# EAGLE design RhythmMachine-Master (EAGLE 7.2.0)
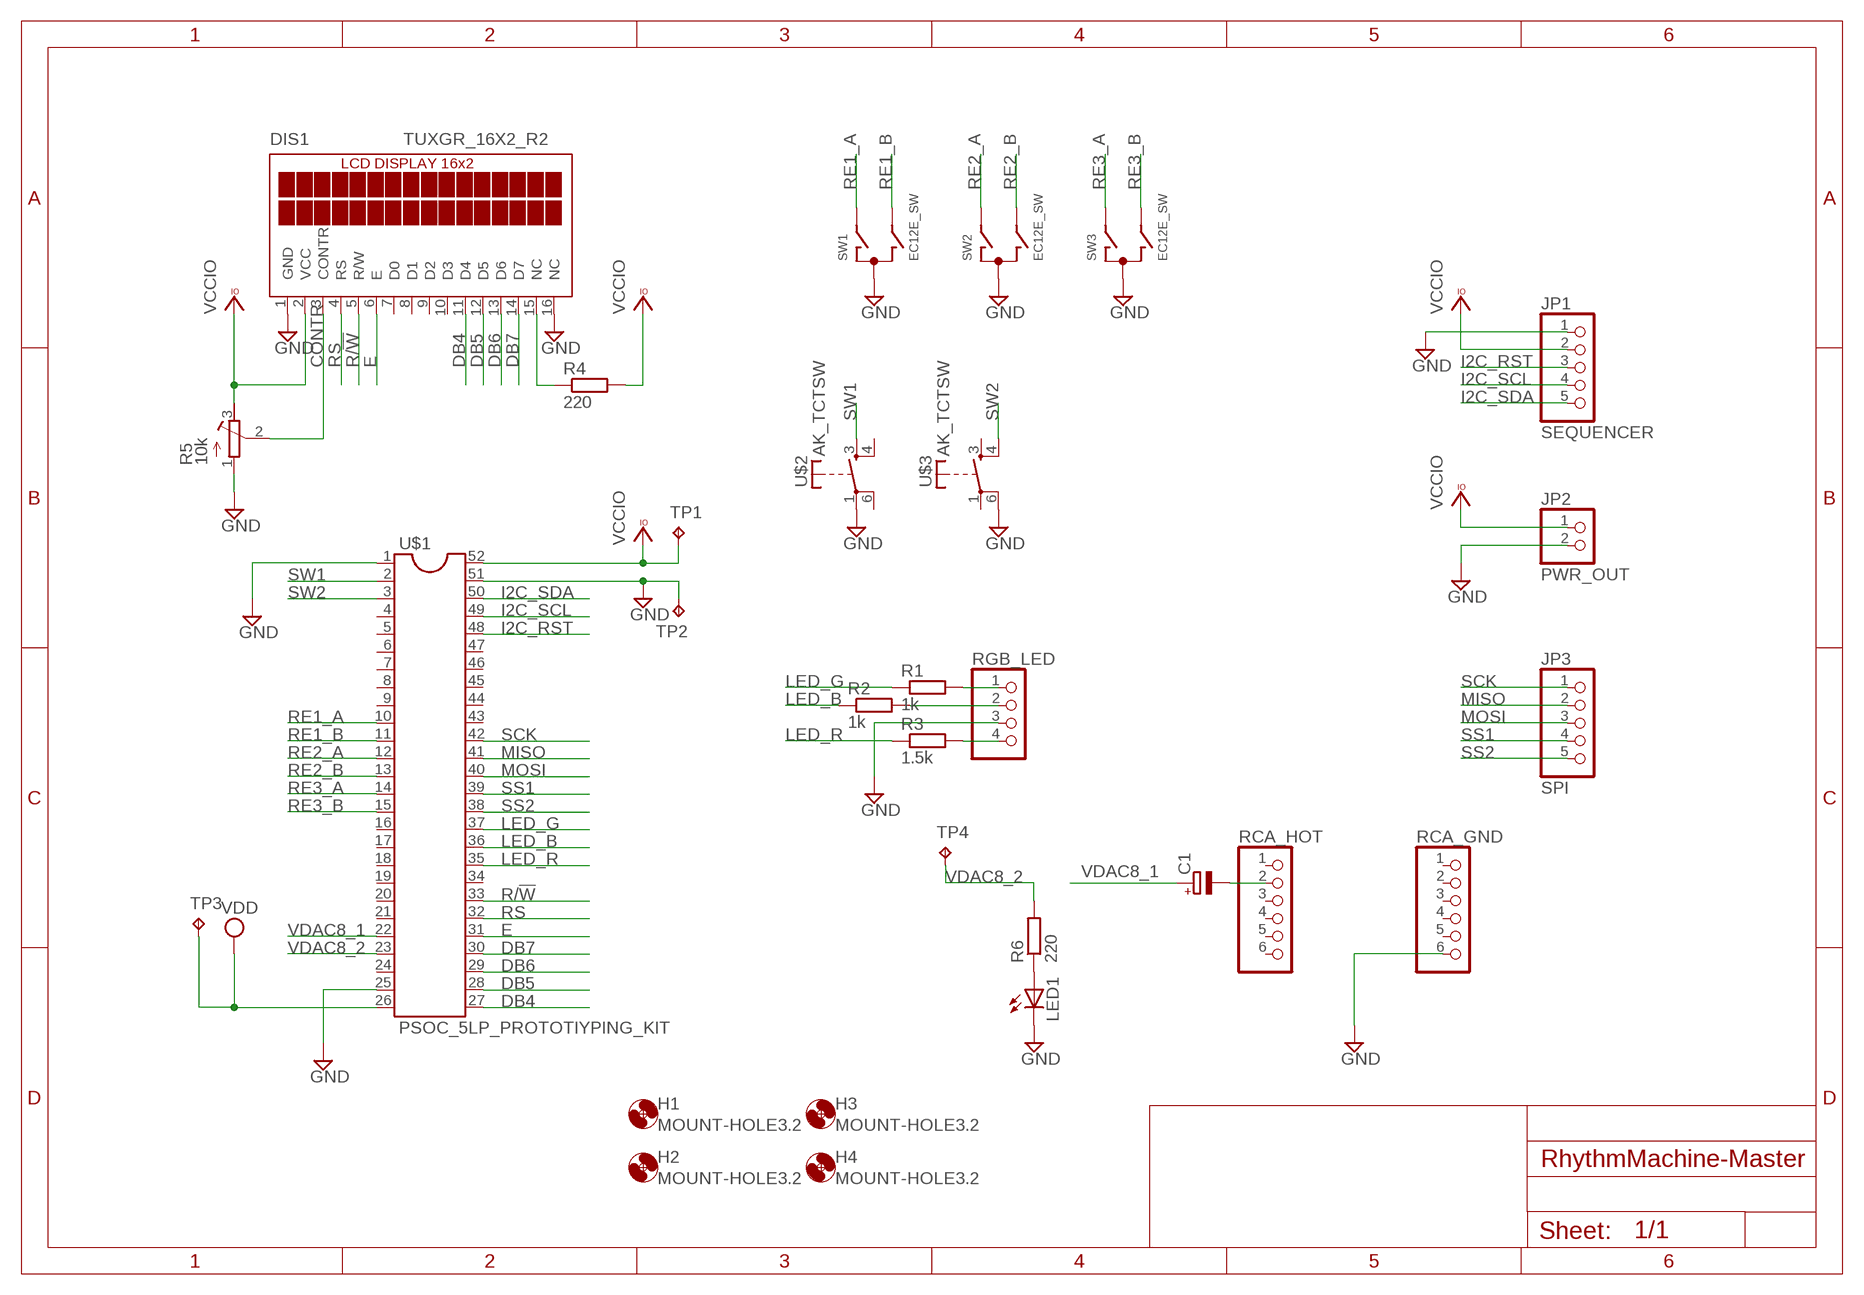
[diagram p0: schematic, sheet 1]

## Parts
C1  CPOL-EUE2.5-7  [E2,5-7]
DIS1  TUXGR_16X2_R2  [TUXGR_16X2_R2]
H1  MOUNT-HOLE3.2  [3,2]
H2  MOUNT-HOLE3.2  [3,2]
H3  MOUNT-HOLE3.2  [3,2]
H4  MOUNT-HOLE3.2  [3,2]
JP1  SEQUENCER  PINHD-1X5/90  [1X05/90]
JP2  PWR_OUT  PINHD-1X2/90  [1X02/90]
JP3  SPI  PINHD-1X5/90  [1X05/90]
LED1  LED3MM  [LED3MM]
R1  1k  R-EU_0207/7  [0207/7]
R2  1k  R-EU_0207/7  [0207/7]
R3  1.5k  R-EU_0207/7  [0207/7]
R4  220  R-EU_0207/7  [0207/7]
R5  10k  R-TRIMM3339P  [RTRIM3339P]
R6  220  R-EU_0207/7  [0207/7]
RCA_GND  PINHD-1X6  [1X06]
RCA_HOT  PINHD-1X6  [1X06]
RGB_LED  PINHD-1X4  [1X04]
SW1  EC12E_SW  [ALPS_EC12E_SW]
SW2  EC12E_SW  [ALPS_EC12E_SW]
SW3  EC12E_SW  [ALPS_EC12E_SW]
TP1  TPPAD1-13  [P1-13]
TP2  TPPAD1-13  [P1-13]
TP3  TPPAD1-13  [P1-13]
TP4  TPPAD1-13  [P1-13]
U$1  PSOC_5LP_PROTOTIYPING_KIT  [DIL52-8]
U$2  AK_TCTSW  [TME1]
U$3  AK_TCTSW  [TME1]

## Nets
CONTR: DIS1.3(CONTR) R5.2(S)
DB4: DIS1.11(D4) U$1.27
DB5: DIS1.12(D5) U$1.28
DB6: DIS1.13(D6) U$1.29
DB7: DIS1.14(D7) U$1.30
E: DIS1.6(E) U$1.31
GND: DIS1.1(GND) DIS1.16(NC) JP1.1 JP2.2 LED1.K(C) R5.1(A) RCA_GND.6 RGB_LED.3 SW1.C SW2.C SW3.C TP2.TP U$1.1 U$1.25 U$1.51 U$2.1(P) U$3.6(P)
I2C_RST: JP1.3 U$1.48
I2C_SCL: JP1.4 U$1.49
I2C_SDA: JP1.5 U$1.50
LED_B: R2.1 U$1.36
LED_G: R1.1 U$1.37
LED_R: R3.1 U$1.35
MISO: JP3.2 U$1.41
MOSI: JP3.3 U$1.40
N$1: R1.2 RGB_LED.1
N$2: R2.2 RGB_LED.2
N$3: R3.2 RGB_LED.4
N$4: DIS1.15(NC) R4.1
N$5: LED1.A R6.1
N$6: C1.- RCA_HOT.2
R/!W: DIS1.5(R/W) U$1.33
RE1_A: SW1.A U$1.10
RE1_B: SW1.B U$1.11
RE2_A: SW2.A U$1.12
RE2_B: SW2.B U$1.13
RE3_A: SW3.A U$1.14
RE3_B: SW3.B U$1.15
RS: DIS1.4(RS) U$1.32
SCK: JP3.1 U$1.42
SS1: JP3.4 U$1.39
SS2: JP3.5 U$1.38
SW1: U$1.2 U$2.3(S)
SW2: U$1.3 U$3.4(S)
VCCIO: DIS1.2(VCC) JP1.2 JP2.1 R4.2 R5.3(E) TP1.TP U$1.52
VDAC8_1: C1.+ U$1.22
VDAC8_2: R6.2 TP4.TP U$1.23
VDD: TP3.TP U$1.26
Unconnected: DIS1.7(D0) DIS1.8(D1) DIS1.9(D2) DIS1.10(D3) RCA_GND.1 RCA_GND.2 RCA_GND.3 RCA_GND.4 RCA_GND.5 RCA_HOT.1 RCA_HOT.3 RCA_HOT.4 RCA_HOT.5 RCA_HOT.6 SW1.D SW1.E SW1.GND1(G) SW1.GND2(G) SW2.D SW2.E SW2.GND1(G) SW2.GND2(G) SW3.D SW3.E SW3.GND1(G) SW3.GND2(G) U$1.4 U$1.5 U$1.6 U$1.7 U$1.8 U$1.9 U$1.16 U$1.17 U$1.18 U$1.19 U$1.20 U$1.21 U$1.24 U$1.34 U$1.43 U$1.44 U$1.45 U$1.46 U$1.47 U$2.4(S) U$2.6(P) U$3.1(P) U$3.3(S)

## Library data of the parts
C1 = rcl:CPOL-EU: POLARIZED CAPACITOR, European symbol
DIS1 = display-lcd:TUXGR_16X2_R2: Tuxgraphics LCD display 16x2 characters reflective, without background light Source: tuxgr_12x2_r2.pdf; OC_FARNELL: unknown; OC_NEWARK: unknown
H1-H4 = holes:MOUNT-HOLE: MOUNTING HOLE with drill center marker
JP1 JP3 = pinhead:PINHD-1X5: PIN HEADER
JP2 = pinhead:PINHD-1X2: PIN HEADER
LED1 = led:LED: LED OSRAM: - CHIPLED LG R971, LG N971, LY N971, LG Q971, LY Q971, LO R971, LY R971 LH N974, LH R974 LS Q976, LO Q976, LY Q976 LO Q996 - Hyper CHIPLED LW Q18S LB Q993, LB Q99A, LB R99A - SideLED LS A670, LO A670, LY A670, LG A670, LP A670 LB A673, LV A673, LT A673, LW A673 LH A674 LY A675 LS A676, LA A676, LO A676, LY A676, LW A676 LS A679, LY A679, LG A679 - Hyper Micro SIDELED® LS Y876, LA Y876, LO Y876, LY Y876 LT Y87S - SmartLED LW L88C, LW L88S LB L89C, LB L89S, LG L890 LS L89K, LO L89K, LY L89K LS L896, LA L896, LO L896, LY L896 - TOPLED LS T670, LO T670, LY T670, LG T670, LP T670 LSG T670, LSP T670, LSY T670, LOP T670, LYG T670 LG T671, LOG T671, LSG T671 LB T673, LV T673, LT T673, LW T673 LH T674 LS T676, LA T676, LO T676, LY T676, LB T676, LH T676, LSB T676, LW T676 LB T67C, LV T67C, LT T67C, LS T67K, LO T67K, LY T67K, LW E67C LS E67B, LA E67B, LO E67B, LY E67B, LB E67C, LV E67C, LT E67C LW T67C LS T679, LY T679, LG T679 LS T770, LO T770, LY T770, LG T770, LP T770 LB T773, LV T773, LT T773, LW T773 LH T774 LS E675, LA E675, LY E675, LS T675 LS T776, LA T776, LO T776, LY T776, LB T776 LHGB T686 LT T68C, LB T68C - Hyper Mini TOPLED® LB M676 - Mini TOPLED Santana® LG M470 LS M47K, LO M47K, LY M47K Source: http://www.osram.convergy.de LUXEON: - LUMILED® LXK2-PW12-R00, LXK2-PW12-S00, LXK2-PW14-U00, LXK2-PW14-V00 LXK2-PM12-R00, LXK2-PM12-S00, LXK2-PM14-U00 LXK2-PE12-Q00, LXK2-PE12-R00, LXK2-PE12-S00, LXK2-PE14-T00, LXK2-PE14-U00 LXK2-PB12-K00, LXK2-PB12-L00, LXK2-PB12-M00, LXK2-PB14-N00, LXK2-PB14-P00, LXK2-PB14-Q00 LXK2-PR12-L00, LXK2-PR12-M00, LXK2-PR14-Q00, LXK2-PR14-R00 LXK2-PD12-Q00, LXK2-PD12-R00, LXK2-PD12-S00 LXK2-PH12-R00, LXK2-PH12-S00 LXK2-PL12-P00, LXK2-PL12-Q00, LXK2-PL12-R00 Source: www.luxeon.com KINGBRIGHT: KA-3528ASYC Source: www.kingbright.com
R1-R4 R6 = rcl:R-EU_: RESISTOR, European symbol
R5 = rcl:R-TRIMM: Trimm resistor
RCA_GND RCA_HOT = pinhead:PINHD-1X6: PIN HEADER
RGB_LED = pinhead:PINHD-1X4: PIN HEADER
SW1-SW3 = switch-alps:EC12E_SW: ALPS rotary Encoder EC12E series with switch; MPN: EC12E2424407; OC_FARNELL: 1520813; OC_NEWARK: 74M1068
TP1-TP4 = testpad:TP: Test pad
U$1 = mylib:PSOC_5LP_PROTOTIYPING_KIT: PSoC 5LP Prototyping Kit
U$2 U$3 = mylib:AK_TCTSW

## Board
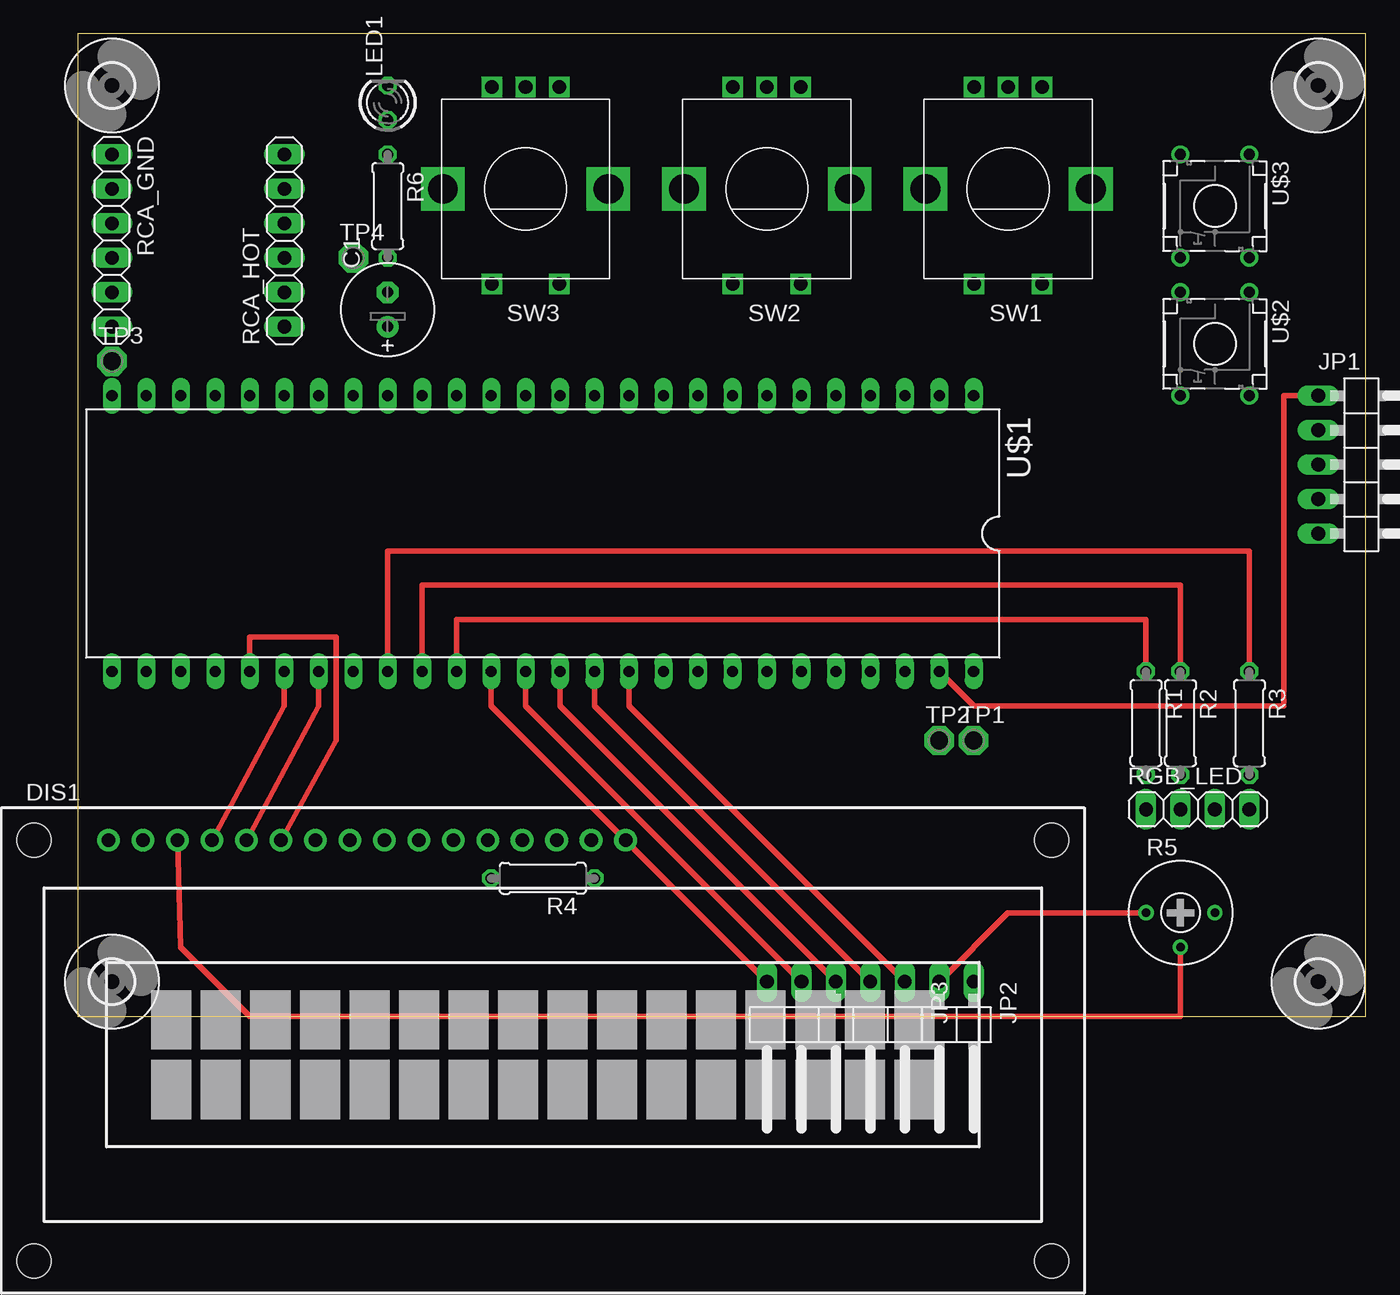
[diagram p1: board, top side]
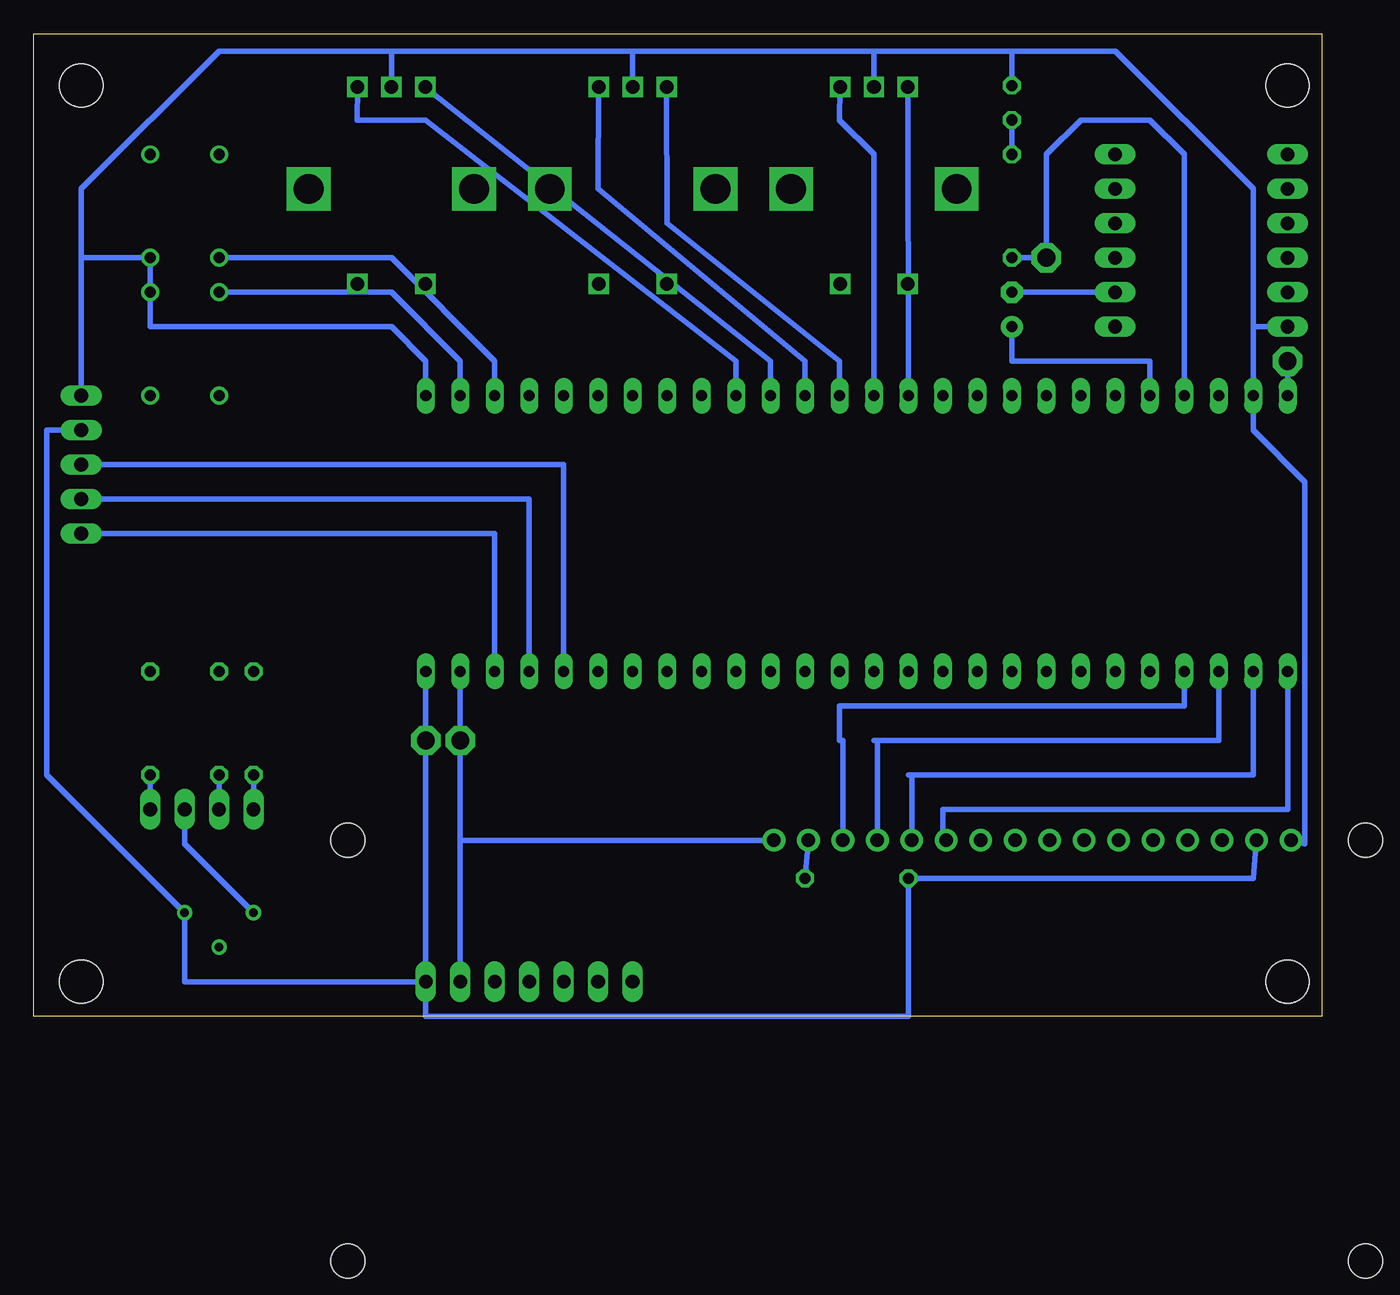
[diagram p2: board, bottom side, seen from below]

Size 94.92 x 72.38 mm. Coordinates in mm from the lower left corner, seen from the top.
Outline: 0,0 94.92,0 94.92,72.38 0,72.38 0,0
Copper layers (1*16): Top 0.035mm / dielectric 1.5mm / Bottom 0.035mm
Design rules "default": minimum track width 10mil, minimum drill 24mil, track to track 8mil, track to pad 8mil, pad to pad 8mil, via to via 8mil, smd to smd 8mil, copper to edge 40mil, drill to drill 8mil, minimum pad ring 10mil, minimum via ring 8mil, stop-mask expansion 4mil, vias tented up to drill 0mil, thermal gap 10mil

### Footprints (pad centres in the part's own frame; a part is rotated, then mirrored left to right if it is on the bottom)
E2,5-7 = drill 0.813 pad 1.6: + -1.27,0 | drill 0.813 pad 1.6 octagon: - 1.27,0
TUXGR_16X2_R2 = drill 1 pad 1.676: 1 -32,15.5; 2 -29.46,15.5; 3 -26.92,15.5; 4 -24.38,15.5; 5 -21.84,15.5; 6 -19.3,15.5; 7 -16.76,15.5; 8 -14.22,15.5; 9 -11.68,15.5; 10 -9.14,15.5; 11 -6.6,15.5; 12 -4.06,15.5; 13 -1.52,15.5; 14 1.02,15.5; 15 3.56,15.5; 16 6.1,15.5 | hole 2.5: -37.5,-15.5; 37.5,-15.5; -37.5,15.5; 37.5,15.5
3,2 = hole 3.2: 0,0
1X05/90 = drill 1.016 long: 1 -5.08,-3.81; 2 -2.54,-3.81; 3 0,-3.81; 4 2.54,-3.81; 5 5.08,-3.81
1X02/90 = drill 1.016 long: 1 -1.27,-3.81; 2 1.27,-3.81
LED3MM = drill 0.813 octagon: A -1.27,0; K 1.27,0
0207/7 = drill 0.813 octagon: 1 -3.81,0; 2 3.81,0
RTRIM3339P = drill 0.61: 1 -2.54,0; 2 0,-2.54; 3 2.54,0
1X06 = drill 1.016 long: 1 -6.35,0; 2 -3.81,0; 3 -1.27,0; 4 1.27,0; 5 3.81,0; 6 6.35,0
1X04 = drill 1.016 long: 1 -3.81,0; 2 -1.27,0; 3 1.27,0; 4 3.81,0
ALPS_EC12E_SW = drill 1 square: A -2.5,-7.5; B 2.5,-7.5; C 0,-7.5; D -2.5,7; E 2.5,7 | drill 2.2 square: GND1 -6.1,0; GND2 6.1,0
P1-13 = drill 1.321 pad 2.159 octagon: TP 0,0
DIL52-8 = drill 0.813 long: 1 -31.75,-11.43; 2 -29.21,-11.43; 3 -26.67,-11.43; 4 -24.13,-11.43; 5 -21.59,-11.43; 6 -19.05,-11.43; 7 -16.51,-11.43; 8 -13.97,-11.43; 9 -11.43,-11.43; 10 -8.89,-11.43; 11 -6.35,-11.43; 12 -3.81,-11.43; 13 -1.27,-11.43; 14 1.27,-11.43; 15 3.81,-11.43; 16 6.35,-11.43; 17 8.89,-11.43; 18 11.43,-11.43; 19 13.97,-11.43; 20 16.51,-11.43; 21 19.05,-11.43; 22 21.59,-11.43; 23 24.13,-11.43; 24 26.67,-11.43; 25 29.21,-11.43; 26 31.75,-11.43; 27 31.75,8.89; 28 29.21,8.89; 29 26.67,8.89; 30 24.13,8.89; 31 21.59,8.89; 32 19.05,8.89; 33 16.51,8.89; 34 13.97,8.89; 35 11.43,8.89; 36 8.89,8.89; 37 6.35,8.89; 38 3.81,8.89; 39 1.27,8.89; 40 -1.27,8.89; 41 -3.81,8.89; 42 -6.35,8.89; 43 -8.89,8.89; 44 -11.43,8.89; 45 -13.97,8.89; 46 -16.51,8.89; 47 -19.05,8.89; 48 -21.59,8.89; 49 -24.13,8.89; 50 -26.67,8.89; 51 -29.21,8.89; 52 -31.75,8.89
TME1 = drill 0.813: 1 -2.54,-3.81; 3 2.54,-3.81; 4 2.54,3.81; 6 -2.54,3.81

### Placement (x,y rotation side)
C1  22.86,52.07 90 top
DIS1  34.29,-2.54 0 top
H1  2.54,68.58 0 top
H2  2.54,2.54 0 top
H3  91.44,68.58 0 top
H4  91.44,2.54 0 top
JP1  95.25,40.64 270 top
JP2  64.77,-1.27 180 top
JP3  55.88,-1.27 180 top
LED1  22.86,67.31 90 top
R1  78.74,21.59 270 top
R2  81.28,21.59 270 top
R3  86.36,21.59 270 top
R4  34.29,10.16 180 top
R5  81.28,7.62 0 top
R6  22.86,59.69 270 top
RCA_GND  2.54,57.15 270 top
RCA_HOT  15.24,57.15 90 top
RGB_LED  82.55,15.24 0 top
SW1  68.58,60.96 180 top
SW2  50.8,60.96 180 top
SW3  33.02,60.96 180 top
TP1  66.04,20.32 0 top
TP2  63.5,20.32 0 top
TP3  2.54,48.26 0 top
TP4  20.32,55.88 0 top
U$1  34.29,34.29 180 top
U$2  83.82,49.53 180 top
U$3  83.82,59.69 180 top

### Tracks (layer width: path | path; a pad name or v marks a point on that pad's centre or on a via)
CONTR
  Top 0.406: R5.2 81.28,0 12.7,0 7.62,5.08 DIS1.3
DB4
  Bottom 0.406: U$1.27 2.54,15.24 27.94,15.24 27.94,12.7 27.69,12.7 DIS1.11
DB5
  Bottom 0.406: U$1.28 5.08,17.78 30.23,17.78 | 30.48,17.78 30.23,17.78 | 30.23,17.78 DIS1.12
DB6
  Bottom 0.406: U$1.29 7.62,20.32 32.77,20.32 | 33.02,20.32 32.77,20.32 | 32.77,20.32 DIS1.13
DB7
  Bottom 0.406: U$1.30 10.16,22.86 35.56,22.86 35.56,20.32 35.31,20.32 DIS1.14
E
  Top 0.406: DIS1.6 19.05,20.32 19.05,27.94 12.7,27.94 U$1.31
GND
  Top 0.406: R5.1 68.58,7.62 JP2.2 | U$1.51 66.04,22.86 88.9,22.86 88.9,45.72 JP1.1
  Bottom 0.406: 5.08,50.8 U$1.25 5.08,43.18 1.27,39.37 1.27,12.7 DIS1.1 | 5.08,50.8 RCA_GND.6 | 5.08,50.8 5.08,60.96 15.24,71.12 22.86,71.12 | 22.86,71.12 33.02,71.12 | 33.02,71.12 50.8,71.12 | 50.8,71.12 68.58,71.12 | SW1.C 68.58,71.12 | SW2.C 50.8,71.12 | SW3.C 33.02,71.12 | LED1.K 22.86,71.12 | JP1.1 91.44,55.88 | 91.44,55.88 91.44,60.96 81.28,71.12 68.58,71.12 | 91.44,55.88 U$3.6 U$2.1 86.36,50.8 68.58,50.8 66.04,48.26 U$1.1 | RGB_LED.3 83.82,12.7 R5.1 | U$1.51 TP2.TP 63.5,12.96 | JP2.2 63.5,12.7 63.5,12.96 | DIS1.16 63.5,12.96
I2C_RST
  Bottom 0.406: U$1.48 55.88,40.64 JP1.3
I2C_SCL
  Bottom 0.406: U$1.49 58.42,38.1 JP1.4
I2C_SDA
  Bottom 0.406: U$1.50 60.96,35.56 JP1.5
LED_B
  Top 0.406: R2.1 81.28,31.75 25.4,31.75 U$1.36
LED_G
  Top 0.406: R1.1 78.74,29.21 27.94,29.21 U$1.37
LED_R
  Top 0.406: R3.1 86.36,34.29 22.86,34.29 U$1.35
MISO
  Top 0.406: U$1.41 38.1,22.86 JP3.2
MOSI
  Top 0.406: U$1.40 35.56,22.86 JP3.3
N$1
  Bottom 0.406: R1.2 RGB_LED.1
N$2
  Bottom 0.406: R2.2 RGB_LED.2
N$3
  Bottom 0.406: R3.2 RGB_LED.4
N$4
  Bottom 0.406: DIS1.15 R4.1
N$5
  Bottom 0.406: R6.1 LED1.A
N$6
  Bottom 0.406: RCA_HOT.2 C1.-
R/!W
  Top 0.406: U$1.33 17.78,22.86 DIS1.5
RE1_A
  Bottom 0.406: U$1.10 43.18,48.26 66.04,66.04 71.12,66.04 SW1.A
RE1_B
  Bottom 0.406: U$1.11 40.64,48.26 SW1.B
RE2_A
  Bottom 0.406: U$1.12 38.1,48.26 53.34,60.96 SW2.A
RE2_B
  Bottom 0.406: U$1.13 35.56,48.26 48.26,58.42 SW2.B
RE3_A
  Bottom 0.406: U$1.14 33.02,63.5 35.56,66.04 SW3.A
RE3_B
  Bottom 0.406: U$1.15 SW3.B
RS
  Top 0.406: U$1.32 15.24,22.86 DIS1.4
SCK
  Top 0.406: U$1.42 40.64,22.86 JP3.1
SS1
  Top 0.406: U$1.39 33.02,22.86 JP3.4
SS2
  Top 0.406: U$1.38 30.48,22.86 JP3.5
SW1
  Bottom 0.406: U$1.2 63.5,48.26 68.58,53.34 U$2.3
SW2
  Bottom 0.406: U$1.3 60.96,48.26 68.58,55.88 U$3.4
VCCIO
  Bottom 0.406: JP1.2 93.98,43.18 93.98,17.78 R5.3 83.82,2.54 JP2.1 | U$1.52 TP1.TP JP2.1 | JP2.1 66.04,0 30.48,0 R4.2 5.08,10.16 DIS1.2
VDAC8_1
  Bottom 0.406: C1.+ 22.86,48.26 12.7,48.26 U$1.22
VDAC8_2
  Bottom 0.406: U$1.23 10.16,63.5 12.7,66.04 17.78,66.04 20.32,63.5 TP4.TP R6.2
VDD
  Bottom 0.406: TP3.TP U$1.26